# Altium schematic sheet test.SchDoc
size A4
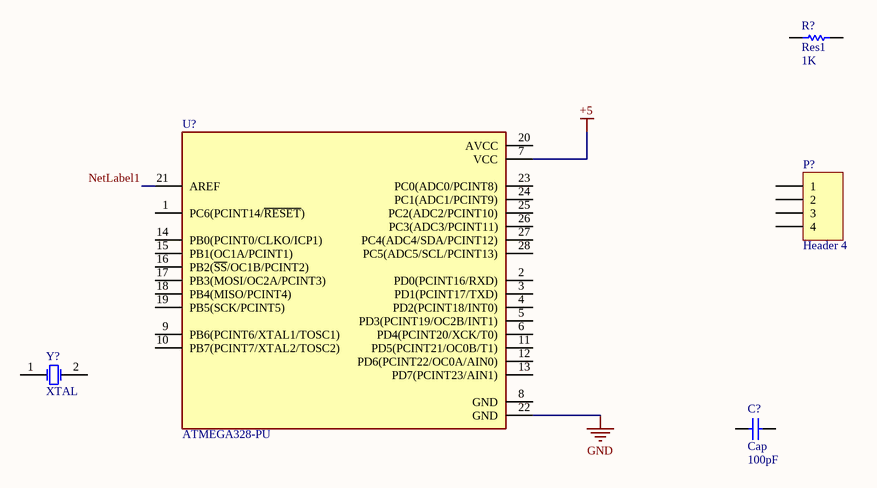
[diagram p0: test.SchDoc]

## Parts
C?  Cap  value 100pF  [RAD-0.3]
P?  Header 4  [HDR1X4]
R?  Res1  value 1K  [AXIAL-0.3]
U?  ATMEGA328-PU  [DIP787W46P254L3467H508Q28]
Y?  XTAL  [R38]

## Nets
+5: U?.7(VCC)
GND: U?.22(GND)
NetLabel1: U?.21(AREF)

Not connected (* = marked no-connect by the designer): C? 1 2; P? 1 2 3 4; R? 1 2; U? 1(PC6(PCINT14/~{RESET})) 2(PD0(PCINT16/RXD)) 3(PD1(PCINT17/TXD)) 4(PD2(PCINT18/INT0)) 5(PD3(PCINT19/OC2B/INT1)) 6(PD4(PCINT20/XCK/T0)) 8(GND) 9(PB6(PCINT6/XTAL1/TOSC1)) 10(PB7(PCINT7/XTAL2/TOSC2)) 11(PD5(PCINT21/OC0B/T1)) 12(PD6(PCINT22/OC0A/AIN0)) 13(PD7(PCINT23/AIN1)) 14(PB0(PCINT0/CLKO/ICP1)) 15(PB1(OC1A/PCINT1)) 16(PB2(~{SS}/OC1B/PCINT2)) 17(PB3(MOSI/OC2A/PCINT3)) 18(PB4(MISO/PCINT4)) 19(PB5(SCK/PCINT5)) 20(AVCC) 23(PC0(ADC0/PCINT8)) 24(PC1(ADC1/PCINT9)) 25(PC2(ADC2/PCINT10)) 26(PC3(ADC3/PCINT11)) 27(PC4(ADC4/SDA/PCINT12)) 28(PC5(ADC5/SCL/PCINT13)); Y? 1(OSC1) 2(OSC2)

## Library data of the parts
C? = Cap: Capacitor; Published: 8-Jun-2000; LatestRevisionDate: 17-Jul-2002; LatestRevisionNote: Re-released for DXP Platform.; PackageReference: RAD-0.3; Publisher: Altium Limited; PackageDescription: Radial Cap, Thru-Hole; 2 Leads; 0.3 in Pin Spacing
P? = Header 4: Header, 4-Pin; LatestRevisionDate: 17-Jul-2002; LatestRevisionNote: Re-released for DXP Platform.; Publisher: Altium Limited
R? = Res1: Resistor; Published: 8-Jun-2000; LatestRevisionDate: 17-Jul-2002; LatestRevisionNote: Re-released for DXP Platform.; PackageReference: AXIAL-0.3; Publisher: Altium Limited; PackageDescription: Axial Device, Thru-Hole; 2 Leads; 0.3 in Pin Spacing
U? = ATMEGA328-PU: AVR AVRÂ® ATmega Microcontroller IC 8-Bit 20MHz 32KB (16K x 16) FLASH 28-PDIP; MF: Microchip Technology; Value: *; Package: DIP-28 Microchip Technology; Availability: In Stock; Check_prices: https://www.snapeda.com/parts/ATMEGA328-PU/Microchip/view-part/?ref=eda; SnapEDA_Link: https://www.snapeda.com/parts/ATMEGA328-PU/Microchip/view-part/?ref=snap; Purchase-URL: https://pricing.snapeda.com/search/part/ATMEGA328-PU/?ref=eda; MP: ATMEGA328-PU; Price: None
Y? = XTAL: Crystal Oscillator; Published: 8-Jun-2000; LatestRevisionDate: 17-Jul-2002; LatestRevisionNote: Re-released for DXP Platform.; PackageReference: R38; Publisher: Altium Limited; PackageDescription: Crystal, Thru-Hole; 2 Leads; Body 3.1 x 8.2 mm (Dia.xH)